# EAGLE design motor (EAGLE 6.4)
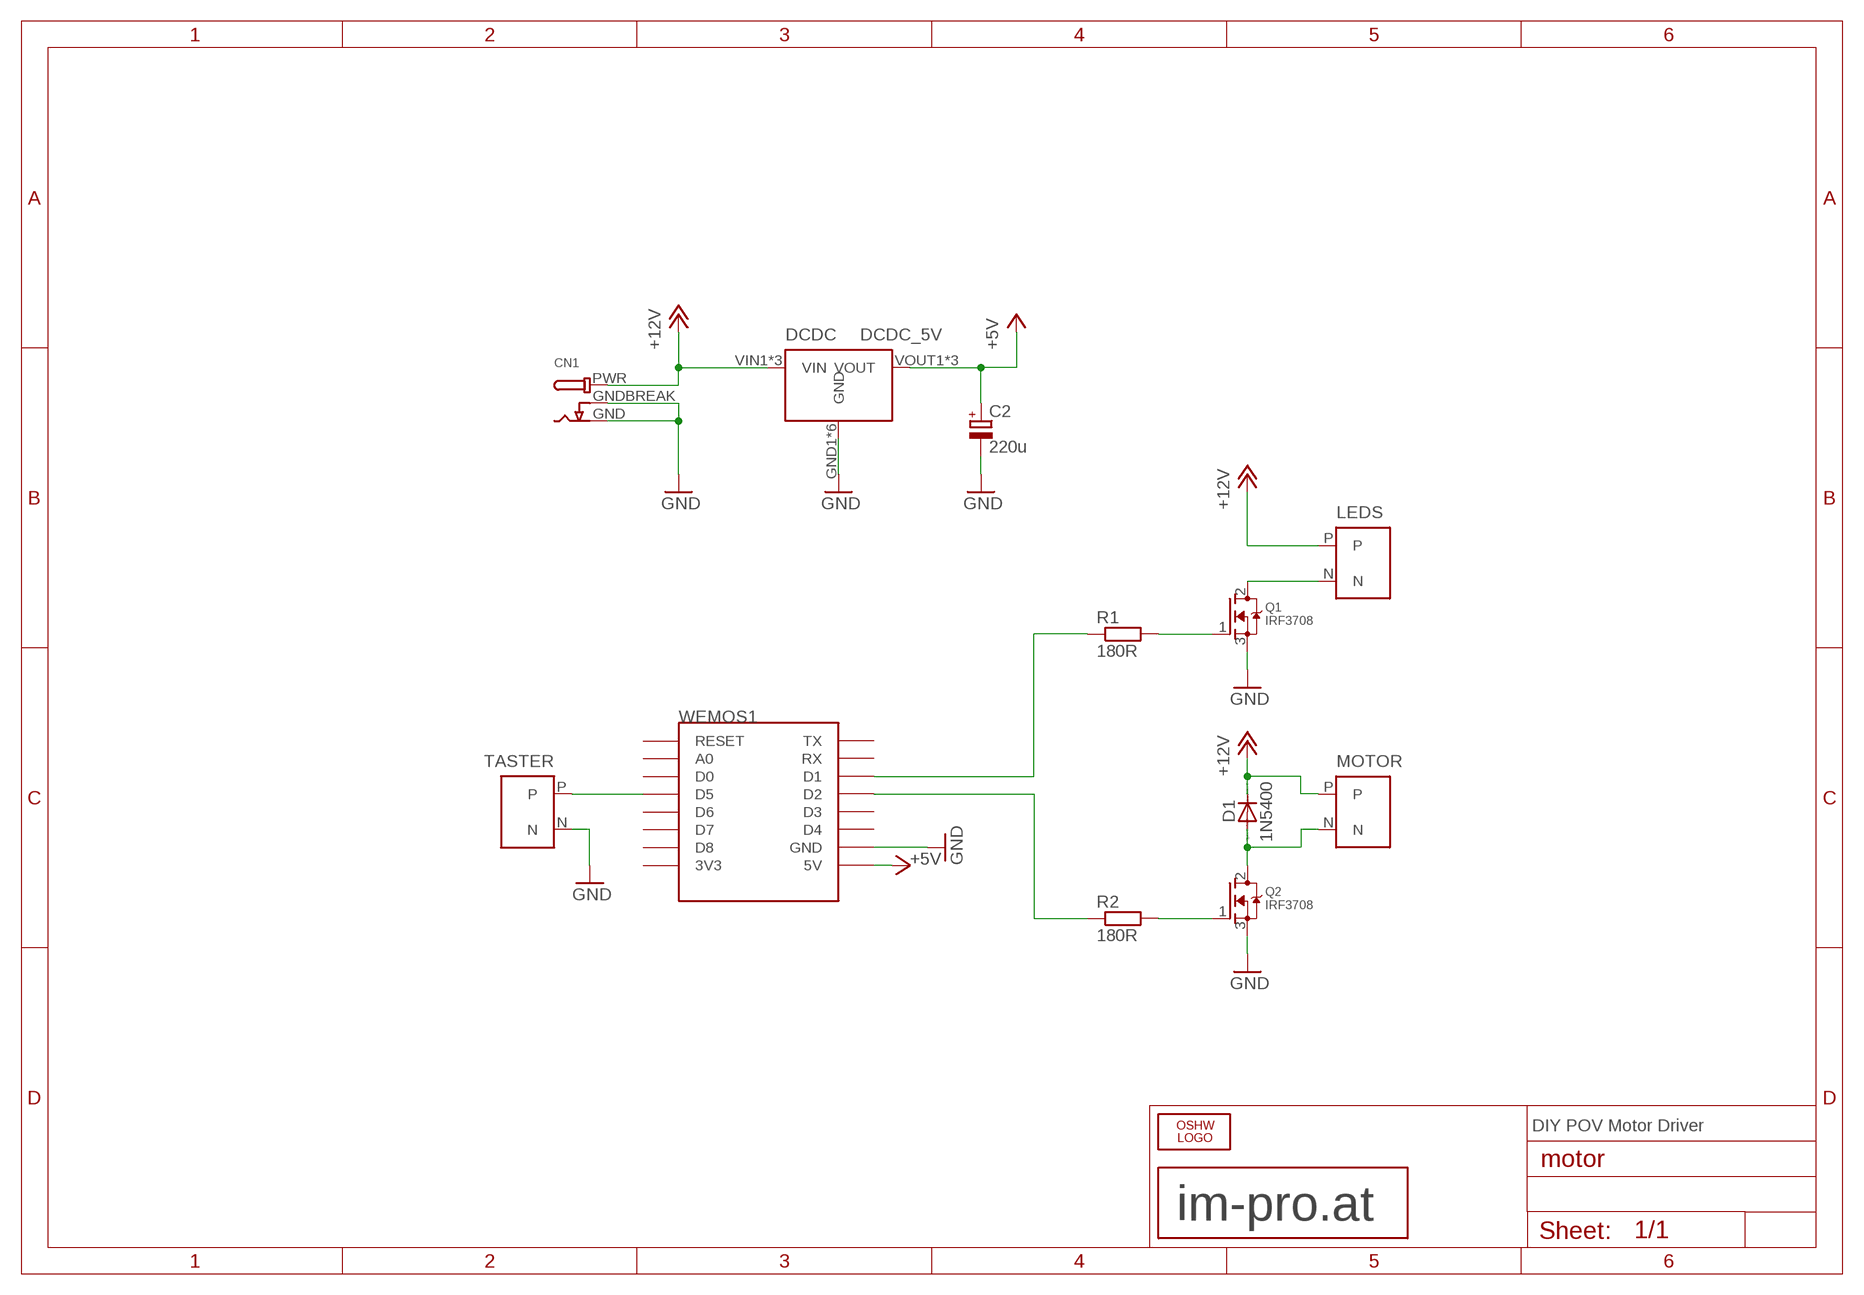
[diagram p0: schematic, sheet 1]

## Parts
C2  220u  CPOL-EUE3.5-8  [E3,5-8]
CN1  DCBARRELPTH  [DCJACK_2MM_PTH]
D1  1N5400  [DO201-15]
DCDC  DCDC_5V  [DCDC]
LEDS  TX30  [XT30]
LOGO1  OSHW_LOGO_FILLX0350-NT  [OSHW_FILLX350_NOTEXT]
MOTOR  TX30  [XT30]
Q1  IRF3708  MOSFET-NGDS_TO220V  [TO220V]
Q2  IRF3708  MOSFET-NGDS_TO220V  [TO220V]
R1  180R  R-EU_0207/10  [0207/10]
R2  180R  R-EU_0207/10  [0207/10]
TASTER  TX30  [XT30]
U$1  LOGO20MM  [LOGO_20MM]
WEMOS1  WEMOS-D1-MINI  [WEMOS-D1-MINI]

## Nets
+5V: C2.+ DCDC.VOUT1(VOUT) DCDC.VOUT2(VOUT) DCDC.VOUT3(VOUT) WEMOS1.5V
+12V: CN1.PWR D1.C DCDC.VIN1(VIN) DCDC.VIN2(VIN) DCDC.VIN3(VIN) LEDS.P MOTOR.P
GND: C2.- CN1.GND CN1.GNDBREAK DCDC.GND1(GND) DCDC.GND2(GND) DCDC.GND3(GND) DCDC.GND4(GND) DCDC.GND5(GND) DCDC.GND6(GND) Q1.3(S) Q2.3(S) TASTER.N WEMOS1.GND
N$1: D1.A MOTOR.N Q2.2(D)
N$2: LEDS.N Q1.2(D)
N$3: R1.1 WEMOS1.D1
N$4: TASTER.P WEMOS1.D5
N$5: R2.1 WEMOS1.D2
N$6: Q2.1(G) R2.2
N$7: Q1.1(G) R1.2
Unconnected: WEMOS1.3V3 WEMOS1.A0 WEMOS1.D0 WEMOS1.D3 WEMOS1.D4 WEMOS1.D6 WEMOS1.D7 WEMOS1.D8 WEMOS1.RESET WEMOS1.RX WEMOS1.TX

## Notes on the sheet
- DIY POV Motor Driver

## Library data of the parts
C2 = rcl:CPOL-EU: POLARIZED CAPACITOR, European symbol
CN1 = microbuilder:DCBARREL: DC Barrel Jack DCJACK_1.3MM_PTH - Through Hole 1.3mm Jack (4UConnector: 05536) DCJACK_2MM_PTH - Through Hole 2.0/2.1 Jack (4UConnector: 05537) DCJACK_2MM_SMT - SMT 2.0/2.1mm Jack(4UConnector: 03267)
D1 = diode:1N5400: DIODE standard rectifier, 3 A, 50 V (Motorola)
DCDC = diypov:DCDC_5V
LEDS MOTOR TASTER = main:TX30
LOGO1 = ohw-logo:OSHW_LOGO_FILL
Q1 Q2 = adafruit:MOSFET-N: N-Channel Mosfet 2N7002E - 60V 260mA SOT23 [Digikey: 2N7002ET1GOSTR-ND] - REEL BSH103 - 30V 850mA SOT23 [Digikey: 568-5013-1-ND]
R1 R2 = rcl:R-EU_: RESISTOR, European symbol
U$1 = im-pro-logo:LOGO
WEMOS1 = esp8266modules:WEMOS-D1-MINI: WeMos.cc D1 mini ESP8266 module

## Board
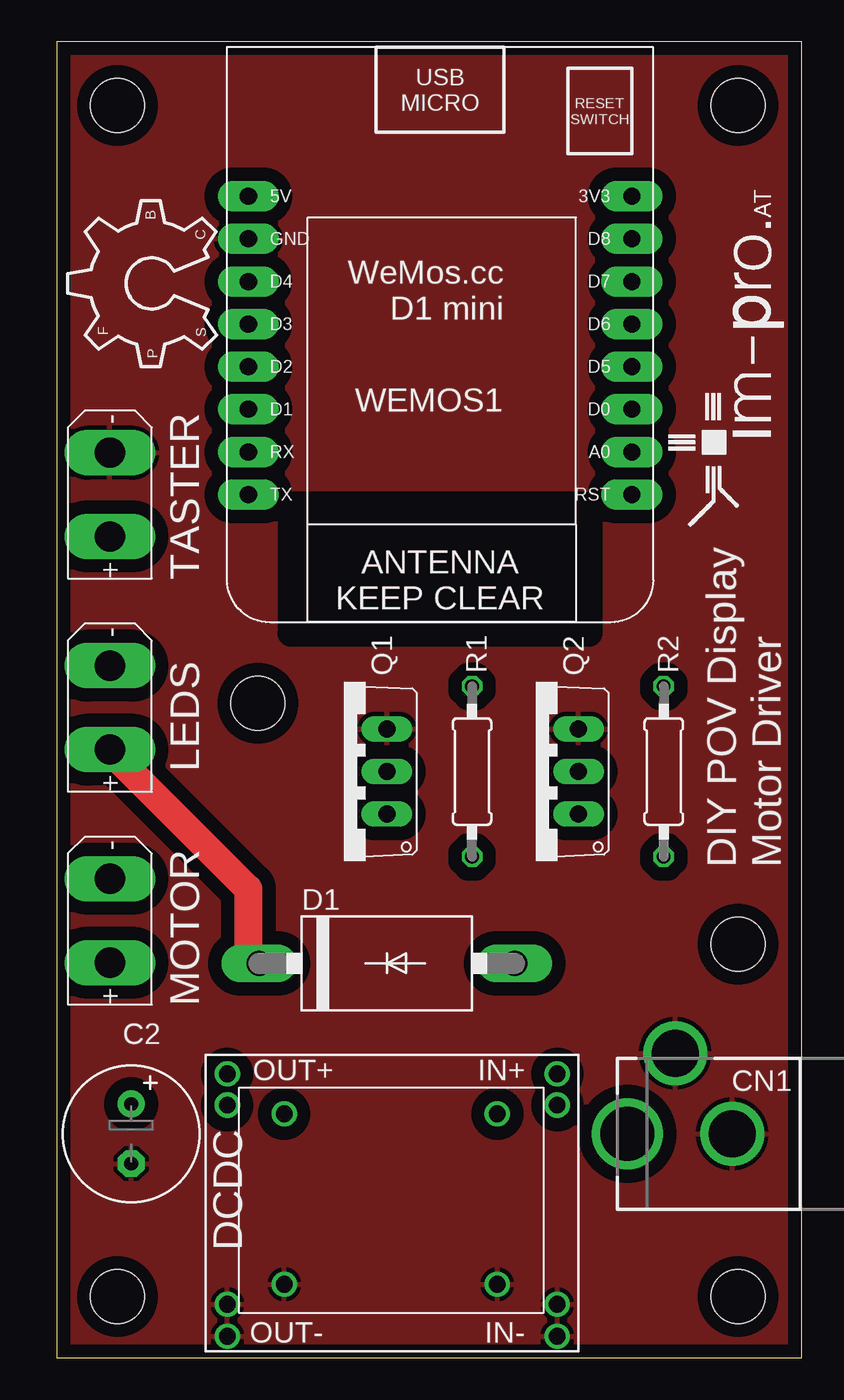
[diagram p1: board, top side]
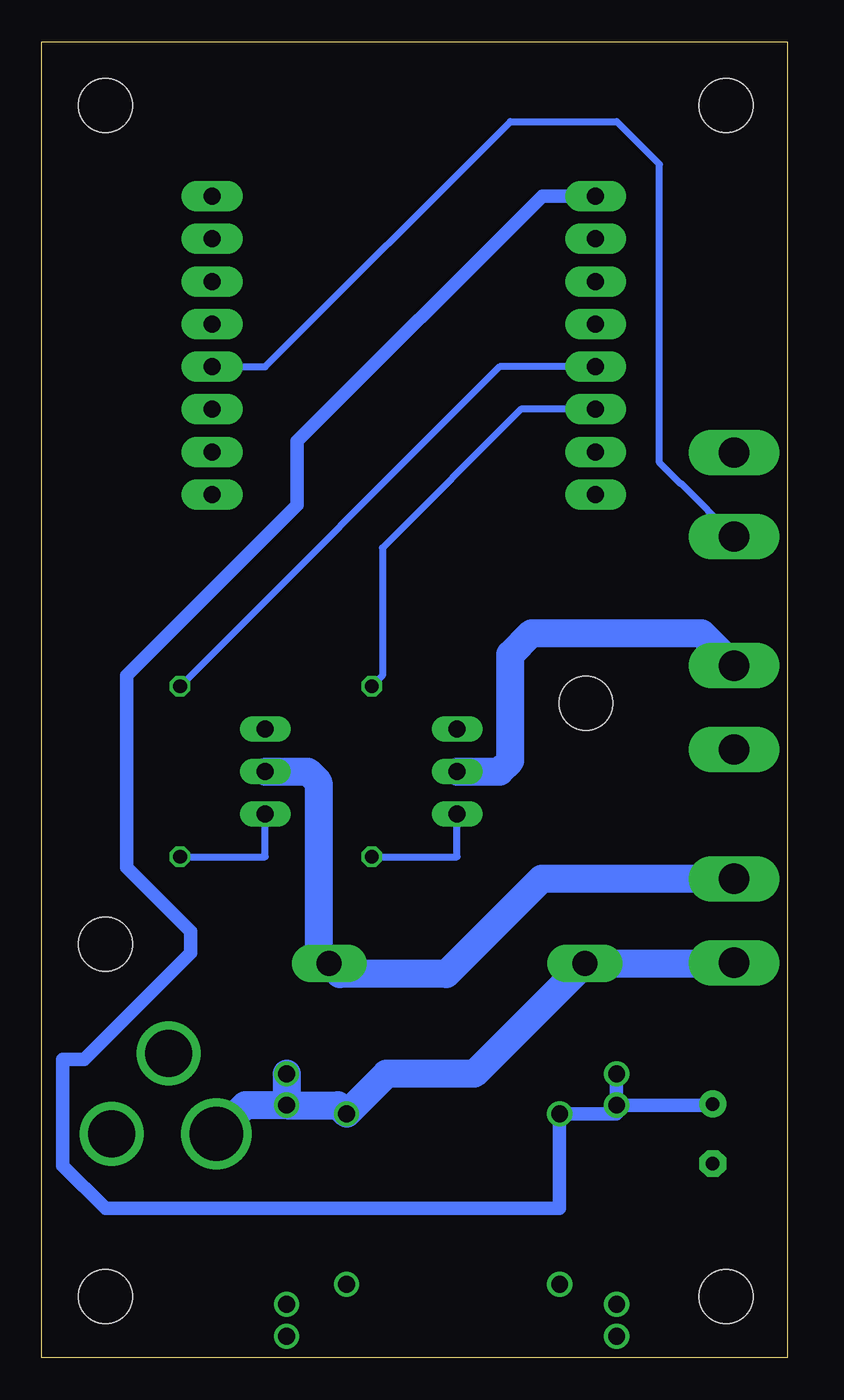
[diagram p2: board, bottom side, seen from below]

Size 44.43 x 78.41 mm. Coordinates in mm from the lower left corner, seen from the top.
Outline: 0,0 44.43,0 44.43,78.41 0,78.41 0,0
Copper layers (1*16): Top 0.035559375mm / dielectric 1.6mm / Bottom 0.035559375mm
Design rules "jlcpcb2layer": minimum track width 5mil, minimum drill 12mil, track to track 5mil, track to pad 5mil, pad to pad 5mil, via to via 5mil, smd to smd 5mil, copper to edge 8mil, drill to drill 6mil, minimum pad ring 5mil, minimum via ring 3mil, stop-mask expansion 2.5mil, vias tented up to drill 0mil, thermal gap 10mil
Holes 3.2 mm at 40.63,3.63 3.63,74.64 40.63,74.64 3.63,3.63 40.63,24.64 12,39
tRestrict: area 14,43.2 to 31.8,50.8

### Footprints (pad centres in the part's own frame; a part is rotated, then mirrored left to right if it is on the bottom)
E3,5-8 = drill 0.813 pad 1.6: + -1.778,0 | drill 0.813 pad 1.6 octagon: - 1.778,0
DCJACK_2MM_PTH = drill 2.8: GND 0,7.35; GNDBREAK 4.8,10.75 | drill 3.2: PWR 0,13.6
DO201-15 = drill 1.499 long: A 7.62,0; C -7.62,0
DCDC = drill 1: GND1 0.635,0; GND2 0.635,-1.905; GND3 20.305,0; GND4 20.305,-1.905; GND5 4.21,-3.1; GND6 16.91,-3.1; VIN1 0.635,-13.775; VIN2 0.635,-15.64; VIN3 4.21,-13.26; VOUT1 20.305,-13.775; VOUT2 20.305,-15.64; VOUT3 16.91,-13.26
XT30 = drill 1.8 long: N 2.5,0; P -2.5,0
TO220V = drill 1.016 long: 1 -2.54,-2.54; 2 0,-2.54; 3 2.54,-2.54
0207/10 = drill 0.813 octagon: 1 -5.08,0; 2 5.08,0
WEMOS-D1-MINI = drill 1.016 pad 1.829 long: 3V3 -10.16,-10.16; 5V 12.7,-10.16; A0 -10.16,5.08; D0 -10.16,2.54; D1 12.7,2.54; D2 12.7,0; D3 12.7,-2.54; D4 12.7,-5.08; D5 -10.16,0; D6 -10.16,-2.54; D7 -10.16,-5.08; D8 -10.16,-7.62; GND 12.7,-7.62; RESET -10.16,7.62; RX 12.7,5.08; TX 12.7,7.62

### Placement (x,y rotation side)
C2  4.45,13.34 270 top
CN1  47.62,13.34 90 top
D1  19.68,23.5 0 top
DCDC  30.48,1.27 180 top
LEDS  3.17,38.73 90 top
LOGO1  9.53,59.05 90 top
MOTOR  3.17,26.04 90 top
Q1  17.14,34.92 90 top
Q2  28.57,34.92 90 top
R1  24.77,34.92 270 top
R2  36.2,34.92 270 top
TASTER  3.17,51.44 90 top
U$1  43.81,49.53 90 top
WEMOS1  24.13,59.05 180 top

### Tracks (layer width: path | path; a pad name or v marks a point on that pad's centre or on a via)
+5V
  Bottom 0.813: WEMOS1.5V 14.61,69.22 29.21,54.61 29.21,50.8 39.37,40.64 39.37,29.21 35.56,25.4 35.56,24.13 41.91,17.78 43.18,17.78 43.18,11.43 40.64,8.89 13.57,8.89 DCDC.VOUT3 10.18,14.53 DCDC.VOUT1 | 4.51,15.04 C2.+ 4.45,15.04 DCDC.VOUT1 | DCDC.VOUT1 DCDC.VOUT2
+12V
  Top 1.676: LEDS.P 3.17,36.2 11.43,27.94 11.43,23.5 D1.C
  Bottom 1.676: MOTOR.P 3.21,23.5 D1.C 18.65,16.91 23.89,16.91 DCDC.VIN3 26.79,15.04 DCDC.VIN1 | DCDC.VIN2 DCDC.VIN1 | DCDC.VIN1 32.31,15.04 CN1.PWR
GND
  pour Top (isolate 0.8): 0,0 44.45,0 44.45,78.11 0,78.11
N$1
  Bottom 1.676: Q2.2 28.57,34.92 27.94,34.29 27.94,24.13 D1.A 26.67,22.86 20.32,22.86 14.64,28.54 MOTOR.N
N$2
  Bottom 1.676: Q1.2 17.14,34.92 16.51,35.56 16.51,41.91 15.24,43.18 5.12,43.18 LEDS.N
N$3
  Bottom 0.406: WEMOS1.D1 15.88,56.52 24.13,48.26 24.13,40.64 R1.1
N$4
  Bottom 0.406: TASTER.P 6.35,52.11 6.39,52.11 7.62,53.34 7.62,71.12 10.16,73.66 16.51,73.66 31.11,59.05 WEMOS1.D5
N$5
  Bottom 0.406: WEMOS1.D2 17.14,59.05 R2.1
N$6
  Bottom 0.406: R2.2 31.11,29.84 Q2.1
N$7
  Bottom 0.406: R1.2 19.68,29.84 Q1.1

### Text on the board
tPlace: DIY POV Display / Motor Driver